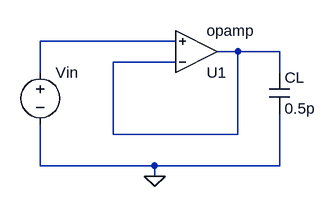
[diagram p0: schematic closed-loop-setup.asc]
closed-loop-setup.asc, the LTspice schematic file:
Version 4
SHEET 1 880 680
WIRE 272 16 64 16
WIRE 368 32 336 32
WIRE 432 32 368 32
WIRE 272 48 176 48
WIRE 64 64 64 16
WIRE 432 64 432 32
WIRE 176 160 176 48
WIRE 368 160 368 32
WIRE 368 160 176 160
WIRE 64 208 64 144
WIRE 240 208 64 208
WIRE 432 208 432 128
WIRE 432 208 240 208
WIRE 240 224 240 208
FLAG 240 224 0
SYMBOL Opamps\\opamp 304 96 M180
SYMATTR InstName U1
SYMBOL cap 416 64 R0
SYMATTR InstName CL
SYMATTR Value 0.5p
SYMBOL voltage 64 48 R0
SYMATTR InstName Vin
SYMATTR Value ""

The netlist it stands for:
* closed-loop-setup.asc
XU1 N002 N001 N002 opamp Aol=100K GBW=10Meg  ; pins invin noninvin out
CL N002 0 0.5p
Vin N001 0
.backanno
.end